# Altium project Proyecto_TD3.PrjPcb
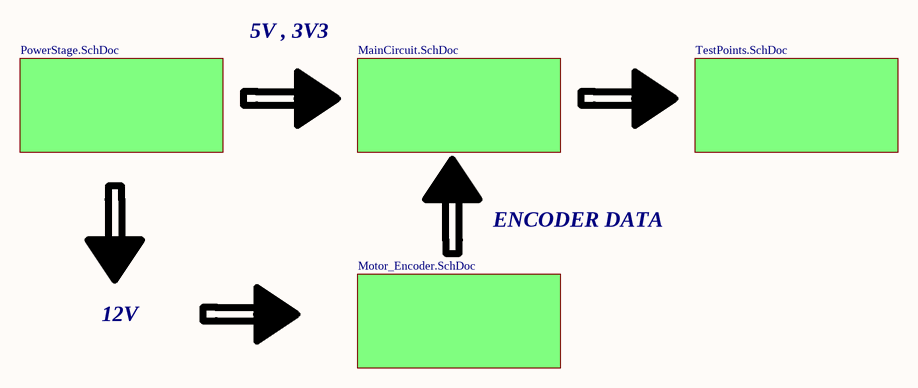
[diagram p0: Main_Sch.SchDoc]
5 sheets, 56 parts. Net scope: global (net labels, ports and power ports of the same name join across sheets).
Board file: PCB1.PcbDoc
Sheets:
  Main_Sch.SchDoc
    Designator = MainCircuit.SchDoc
    Designator = PowerStage.SchDoc
    Designator = Motor_Encoder.SchDoc
    Designator = TestPoints.SchDoc

## Sheet Main_Sch.SchDoc: Controlador PID
size A4; Organization: Altium Limited; Address1: L3, 12a Rodborough Rd; Address2: Frenchs Forest; Address3: NSW; Address4: Australia 2086; Revision: R00; sheetnumberh: 1; sheettotall: 5; Alumno: Irumberry Juan - Matwiejczuk Leandro; Curso: 512; Materia: Técnicas Digitales III; Docentes: Ing. Marín Ariel

### Sub-sheets
Designator = MainCircuit.SchDoc: no entries
Designator = PowerStage.SchDoc: no entries
Designator = Motor_Encoder.SchDoc: no entries
Designator = TestPoints.SchDoc: no entries

### Notes on the sheet
- 5V , 3V3
- ENCODER DATA
- 12V
- Title:
- Revision:
- Alumnos:
- Materia:
- Docente:
- Curso:
- File:
- Date:
- Sheet
- of

## Sheet MainCircuit.SchDoc: Controlador PID
size A4; Organization: Altium Limited; Address1: L3, 12a Rodborough Rd; Address2: Frenchs Forest; Address3: NSW; Address4: Australia 2086; Revision: R00; sheetnumberh: 2; sheettotall: 5; Alumno: Irumberry Juan - Matwiejczuk Leandro; Curso: 512; Materia: Técnicas Digitales III; Docentes: Ing. Marín Ariel; SheetNumber: 2; SheetTotal: 5
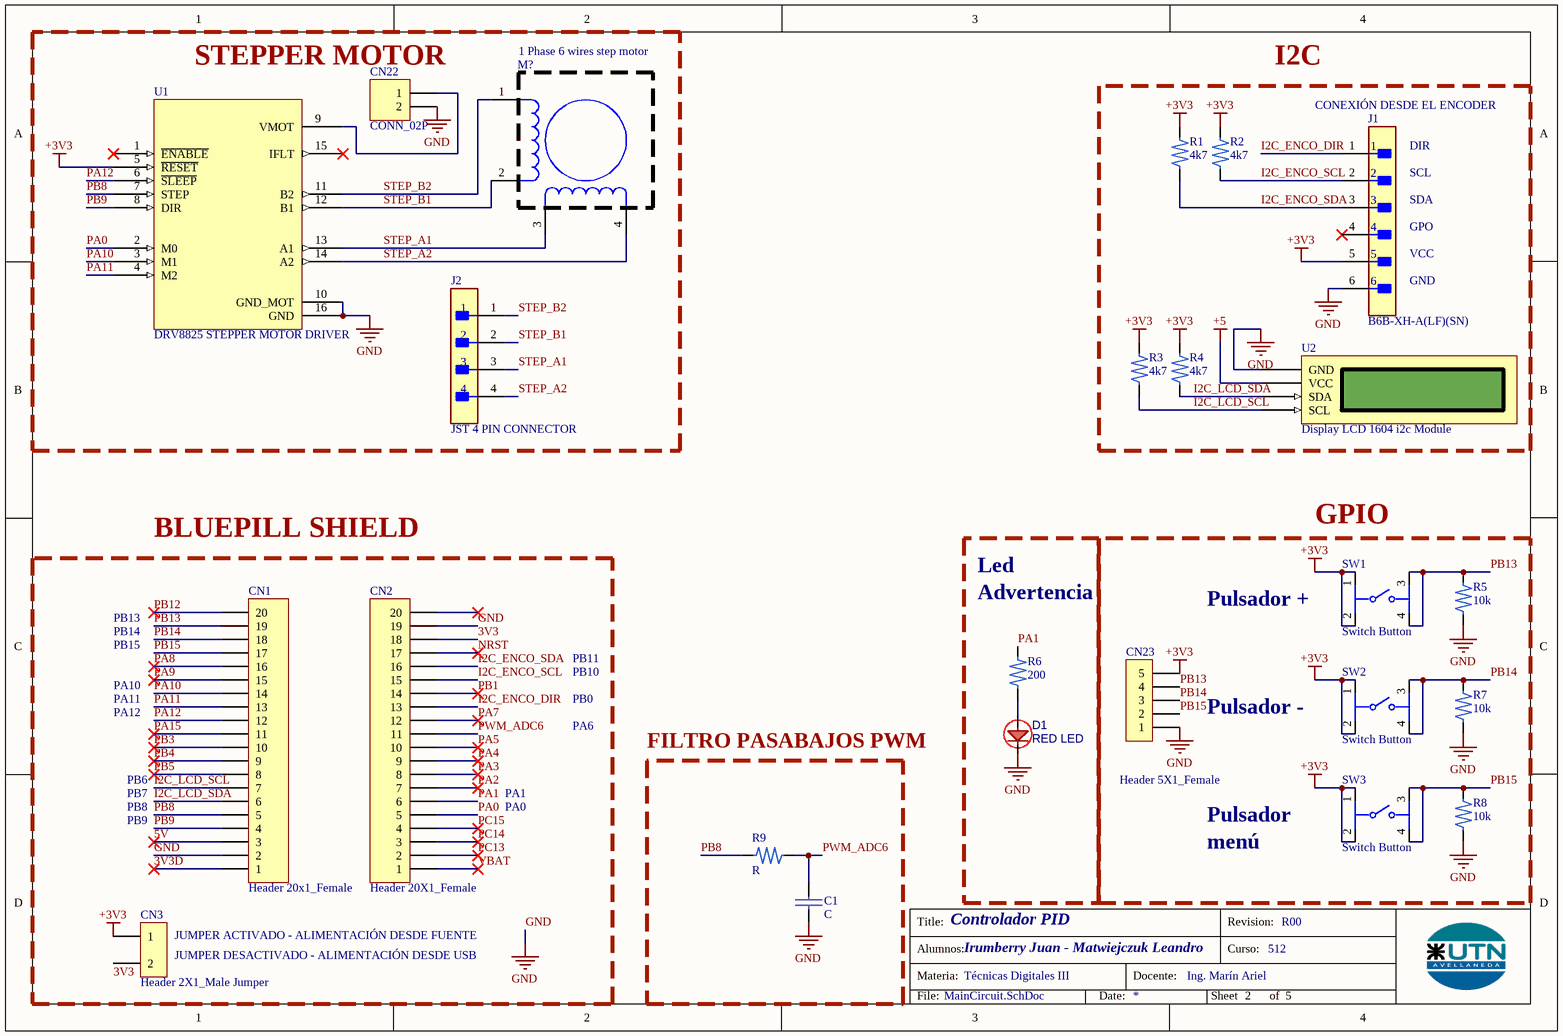
[diagram p1: MainCircuit.SchDoc]

### Parts
C1  C  [CAP_Axial_0.2mm]
CN1  Header 20x1_Female  [SPECIAL P_FEMALE_LEFT_BLUEPILL]
CN2  Header 20X1_Female  [1*20P_FEMALE]
CN3  Header 2X1_Male Jumper  [JUMPER 2x1 PIN]
CN22  CONN_02P  [TERMINAL_BLOCK_2_PIN]
CN23  Header 5X1_Female  [1*5P_FEMALE]
D1  RED LED  [LED_DIODE_3.9mm]
J1  B6B-XH-A(LF)(SN)  [JST 6 PIN CONNECTOR]
J2  JST 4 PIN CONNECTOR  [JST 4 PIN CONNECTOR]
M?  1 Phase 6 wires step motor  (graphical)
R1  4k7  [RES_AXIAL_3.2_6MM]
R2  4k7  [RES_AXIAL_3.2_6MM]
R3  4k7  [RES_AXIAL_3.2_6MM]
R4  4k7  [RES_AXIAL_3.2_6MM]
R5  10k  [RES_AXIAL_3.2_6MM]
R6  200  [RES_AXIAL_3.2_6MM]
R7  10k  [RES_AXIAL_3.2_6MM]
R8  10k  [RES_AXIAL_3.2_6MM]
R9  R  [RES_AXIAL_3.2_6MM]
SW1  Switch Button  [SWITCH]
SW2  Switch Button  [SWITCH]
SW3  Switch Button  [SWITCH]
U1  DRV8825 STEPPER MOTOR DRIVER  [IC_DRV8825_MODULE]
U2  Display LCD 1604 i2c Module  [1*4P_FEMALE]

### Blocks framed on the sheet
STEPPER MOTOR: CN22 J2 M? U1
I2C: J1 R1-R4 U2
BLUEPILL SHIELD: CN1-CN3
GPIO: CN23 R5 R7 R8 SW1-SW3
FILTRO PASABAJOS PWM: C1 R9

### Nets
+3V3: CN3.1 CN23.5 J1.5 R1.2 R2.2 R3.2 R4.2 SW1.1 SW1.2 SW2.1 SW2.2 SW3.1 SW3.2 U1.5(~{RESET})
+5: U2.2(VCC)
GND: C1.2 CN1.2 CN2.19 CN22.2 CN23.1 D1.K J1.6 R5.1 R7.1 R8.1 U1.10(GND_MOT) U1.16(GND) U2.1(GND)
3V3: CN2.18 CN3.2
3V3D: CN1.1
5V: CN1.3
I2C_ENCO_DIR: CN2.13 J1.1
I2C_ENCO_SCL: CN2.15 J1.2 R2.1
I2C_ENCO_SDA: CN2.16 J1.3 R1.1
I2C_LCD_SCL: CN1.7 R3.1 U2.4(SCL)
I2C_LCD_SDA: CN1.6 R4.1 U2.3(SDA)
NRST: CN2.17
PA0: CN2.5 U1.2(M0)
PA1: CN2.6 R6.2
PA2: CN2.7
PA3: CN2.8
PA4: CN2.9
PA5: CN2.10
PA7: CN2.12
PA8: CN1.16
PA9: CN1.15
PA10: CN1.14 U1.3(M1)
PA11: CN1.13 U1.4(M2)
PA12: CN1.12 U1.6(~{SLEEP})
PA15: CN1.11
PB1: CN2.14
PB3: CN1.10
PB4: CN1.9
PB5: CN1.8
PB8: CN1.5 R9.1 U1.7(STEP)
PB9: CN1.4 U1.8(DIR)
PB12: CN1.20
PB13: CN1.19 CN23.4 R5.2 SW1.3 SW1.4
PB14: CN1.18 CN23.3 R7.2 SW2.3 SW2.4
PB15: CN1.17 CN23.2 R8.2 SW3.3 SW3.4
PC13: CN2.2
PC14: CN2.3
PC15: CN2.4
PWM_ADC6: C1.1 CN2.11 R9.2
STEP_A1: J2.3 M?.3 U1.13(A1)
STEP_A2: J2.4 M?.4 U1.14(A2)
STEP_B1: J2.2 M?.2 U1.12(B1)
STEP_B2: J2.1 M?.1 U1.11(B2)
VBAT: CN2.1
NetCN22_1: CN22.1 U1.9(VMOT)
NetD1_A: D1.A R6.1

Not connected (* = marked no-connect by the designer): CN2 20*; J1 4*; U1 1(~{ENABLE})* 15(IFLT)*

### Notes on the sheet
- (near J1) CONEXIÓN DESDE EL ENCODER
- (near J1) DIR
- (near J1) SCL
- (near J1) SDA
- (near J1) GPO
- (near J1) VCC
- (near J1) GND
- Led
- PB14
- PB15
- PB13
- Advertencia
- (near SW1) Pulsador +
- PA10
- PA11
- PA12
- PB10
- PB11
- PB0
- Pulsador -
- PB6
- PA6
- PB7
- PB8
- PB9
- PA1
- PA0
- Pulsador
- menú
- (near CN3) JUMPER ACTIVADO - ALIMENTACIÓN DESDE FUENTE
- (near CN3) JUMPER DESACTIVADO - ALIMENTACIÓN DESDE USB
- Title:
- Revision:
- Alumnos:
- Materia:
- Docente:
- Curso:
- File:
- Date:
- Sheet
- of

### Library data of the parts
C1 = CAP_NP: Non-Polarized Capacitor
CN1 CN2 = Header 20x1_Female: Header, 16-Pin, Single row,female
CN3 = Jumper 2 Pin: Header, 2-Pin, Single row,male; LatestRevisionDate: 17-Jul-2002; LatestRevisionNote: Re-released for DXP Platform.; Publisher: Altium Limited
CN22 = CONN_02P: Connector Generic 2 Vias
CN23 = Header 5X1_Female: Header, 5-Pin, Single row,female; LatestRevisionDate: 17-Jul-2002; LatestRevisionNote: Re-released for DXP Platform.; Publisher: Altium Limited
D1 = LED
J1 = JST 6 PIN: CONN HEADER VERT 6POS 2.5MM
J2 = JST 4 PIN: CONN HEADER VERT 4POS 2.5MM; Number of Contacts: 4; Contact Resistance: 20mR; Voltage Rating: 250V; Max Current Rating: 3A; Gender: Male; Wire/Cable Gauge: 22AWG; Mated Stacking Heights: 9.8mm; Insulation Resistance: 1GR; Orientation: Straight; Contact Type: Male Pin; Contact Finish - Mating: TIN; Series: XH; Max Voltage Rating (AC): 250V; Lead Pitch: 2.5mm; Contact Shape: Square; Insulation Color: Natural; Termination: Solder; Lead Free: Lead Free; Voltage Rating (AC): 250V; Number of Rows: 1; Flammability Rating: UL94 V-0; Number of Positions: 4; Max Operating Temperature: 85°C; Package Quantity: 500; Mount: Through Hole; REACH SVHC: No SVHC; Connector Type: Header; Insulation Material: Nylon; Fastening Type: Detent; Min Operating Temperature: -25°C; Housing Color: White; Packaging: Bulk; Contact Plating: Tin; Contact Material: Brass; Max Voltage Rating (DC): 250V; Housing Material: Polyamide; Color: Natural; Material: Polyamide; Pitch: 2.5mm; Depth: 5.75mm; Current Rating: 3A; Length: 12.4mm
M? = Stepper Motor: Stepper Motor 1 Phase 6 wires
R1-R9 = RES: Through-hole Resistor
SW1-SW3 = Switch Button: SWITCH TACTILE SPST-NO 0.05A 24V; Manufacturer: TE Connectivity; Manufacturer Part Number: 1-1825910-4; Operating Force: 160gf; Contact Current Rating: 50mA; Electromechanical Life: 100000Cycles; Contact Resistance: 100mΩ; Octopart: https://octopart.com/1-1825910-4-te+connectivity-42270468; ComponentLink2URL: https://www.te.com/commerce/DocumentDelivery/DDEController?Action=showdoc&DocId=Customer+Drawing%7F1825910%7FC10%7Fpdf%7FEnglish%7FENG_CD_1825910_C10.pdf%7F1-1825910-4; Throw Configuration: SPST-NO; Height: 9.8mm; Package: 1-1825910-4; Automotive: No; Device Class L2: Switches; Voltage Rating Dc: 24V; Temperature Range High: +85°C; Device Class L3: Tactile Switches; Mouser Description: Tactile Switches 6MM ACTHIGH TEMP TACT SWITCH; Lead Free: Yes; Temperature Range Low: -35°C; Digikey Description: SWITCH TACTILE SPST-NO 0.05A 24V; Device Class L1: Electromechanical; Mount: Through Hole; RoHS: TRUE; ComponentLink2Description: Datasheet; Temperature: -35°C to +85°C; Category: Switch
U1 = DRV8825 Module: DRV8825 STEPPER MOTOR DRIVER ,Stepper, Bipolar 8.2 ~ 45VDC Supply 1.5A 8.2 ~ 45V Load

## Sheet PowerStage.SchDoc: Controlador PID
size A4; Organization: Altium Limited; Address1: L3, 12a Rodborough Rd; Address2: Frenchs Forest; Address3: NSW; Address4: Australia 2086; Revision: R00; sheetnumberh: 3; sheettotall: 5; Alumno: Irumberry Juan - Matwiejczuk Leandro; Curso: 512; Materia: Técnicas Digitales III; Docentes: Ing. Marín Ariel; SheetNumber: 3; SheetTotal: 5
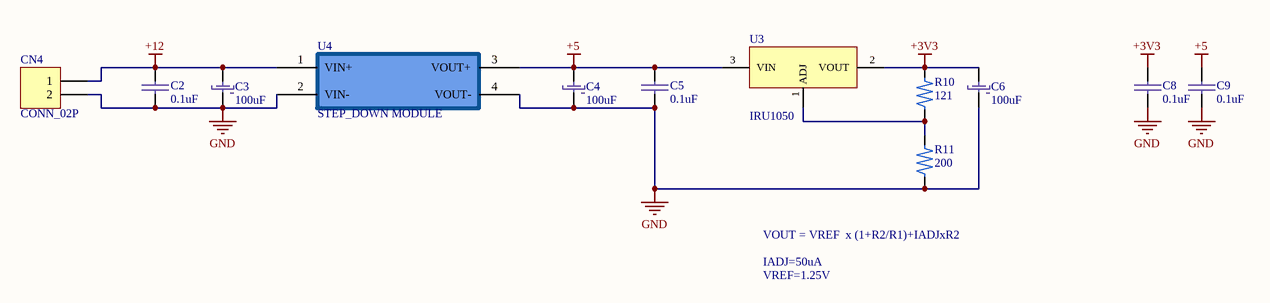
[diagram p2: PowerStage.SchDoc]

### Parts
C2  0.1uF  [CAP_Axial_0.2mm]
C3  100uF  [C_RAD_11MM]
C4  100uF  [C_RAD_5mm]
C5  0.1uF  [CAP_Axial_0.2mm]
C6  100uF  [C_RAD_5mm]
C8  0.1uF  [CAP_Axial_0.2mm]
C9  0.1uF  [CAP_Axial_0.2mm]
CN4  CONN_02P  [TERMINAL_BLOCK_2_PIN]
R10  121  [RES_AXIAL_3.2_6MM]
R11  200  [RES_AXIAL_3.2_6MM]
U3  IRU1050  [IRU1050]
U4  STEP_DOWN MODULE  [STEP_DOWN_MODULE]

### Nets
+3V3: C6.1 C8.1 R10.2 U3.2(VOUT)
+5: C4.1 C5.1 C9.1 U3.3(VIN) U4.3(VOUT+)
+12: C2.1 C3.1 CN4.1 U4.1(VIN+)
GND: C2.2 C3.2 C4.2 C5.2 C6.2 C8.2 C9.2 CN4.2 R11.1 U4.2(VIN-) U4.4(VOUT-)
NetR10_1: R10.1 R11.2 U3.1(ADJ)

### Notes on the sheet
- VOUT = VREF  x (1+R2/R1)+IADJxR2
- IADJ=50uA
- VREF=1.25V
- Title:
- Revision:
- Alumnos:
- Materia:
- Docente:
- Curso:
- File:
- Date:
- Sheet
- of

### Library data of the parts
C2 C5 C8 C9 = CAP_NP: Non-Polarized Capacitor
C3 C4 C6 = Cap_Pol: Polarized Capacitor
CN4 = CONN_02P: Connector Generic 2 Vias
R10 R11 = RES: Through-hole Resistor
U3 = IRU1050: 5A  LOW DROPOUT POSITIVEADJUSTABLE REGULATOR
U4 = STEP_DOWN_MODULE

## Sheet Motor_Encoder.SchDoc: Controlador PID
size A4; Organization: Altium Limited; Address1: L3, 12a Rodborough Rd; Address2: Frenchs Forest; Address3: NSW; Address4: Australia 2086; Revision: R00; sheetnumberh: 4; sheettotall: 5; Alumno: Irumberry Juan - Matwiejczuk Leandro; Curso: 512; Materia: Técnicas Digitales III; Docentes: Ing. Marín Ariel
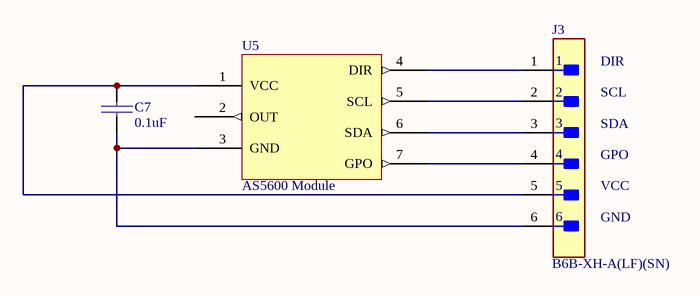
[diagram p3: Motor_Encoder.SchDoc]

### Parts
C7  0.1uF  [CAP_Axial_0.2mm]
J3  B6B-XH-A(LF)(SN)  [JST 6 PIN CONNECTOR]
U5  AS5600 Module  [AS5600 Module]

### Nets
NetC7_1: C7.1 J3.5 U5.1(VCC)
NetC7_2: C7.2 J3.6 U5.3(GND)
NetJ3_1: J3.1 U5.4(DIR)
NetJ3_2: J3.2 U5.5(SCL)
NetJ3_3: J3.3 U5.6(SDA)
NetJ3_4: J3.4 U5.7(GPO)

Not connected (* = marked no-connect by the designer): U5 2(OUT)

### Notes on the sheet
- (near J3) DIR
- (near J3) SCL
- (near J3) SDA
- (near J3) GPO
- (near J3) VCC
- (near J3) GND
- Title:
- Revision:
- Alumnos:
- Materia:
- Docente:
- Curso:
- File:
- Date:
- Sheet
- of

### Library data of the parts
C7 = CAP_NP: Non-Polarized Capacitor
J3 = JST 6 PIN: CONN HEADER VERT 6POS 2.5MM
U5 = AS5600 Module: AS5600 Magnetic Angle Sensor Encoder Module

## Sheet TestPoints.SchDoc: Controlador PID
size A4; Organization: Altium Limited; Address1: L3, 12a Rodborough Rd; Address2: Frenchs Forest; Address3: NSW; Address4: Australia 2086; Revision: R00; sheetnumberh: 5; sheettotall: 5; Alumno: Irumberry Juan - Matwiejczuk Leandro; Curso: 512; Materia: Técnicas Digitales III; Docentes: Ing. Marín Ariel; SheetNumber: 5; SheetTotal: 5
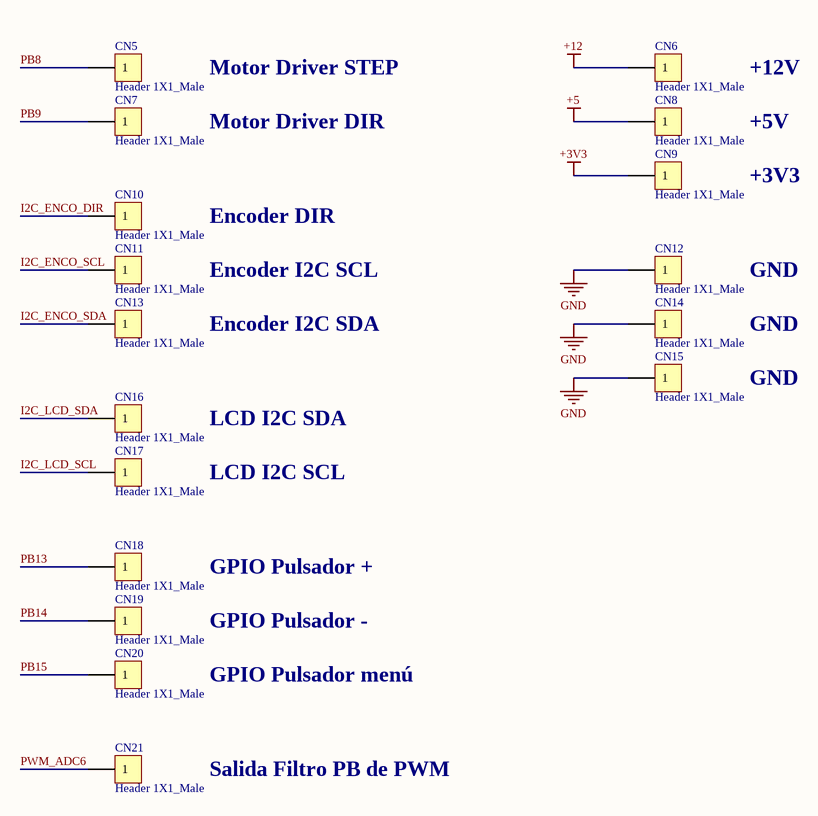
[diagram p4: TestPoints.SchDoc]

### Parts
CN5  Header 1X1_Male  [1*1P_MALE]
CN6  Header 1X1_Male  [1*1P_MALE]
CN7  Header 1X1_Male  [1*1P_MALE]
CN8  Header 1X1_Male  [1*1P_MALE]
CN9  Header 1X1_Male  [1*1P_MALE]
CN10  Header 1X1_Male  [1*1P_MALE]
CN11  Header 1X1_Male  [1*1P_MALE]
CN12  Header 1X1_Male  [1*1P_MALE]
CN13  Header 1X1_Male  [1*1P_MALE]
CN14  Header 1X1_Male  [1*1P_MALE]
CN15  Header 1X1_Male  [1*1P_MALE]
CN16  Header 1X1_Male  [1*1P_MALE]
CN17  Header 1X1_Male  [1*1P_MALE]
CN18  Header 1X1_Male  [1*1P_MALE]
CN19  Header 1X1_Male  [1*1P_MALE]
CN20  Header 1X1_Male  [1*1P_MALE]
CN21  Header 1X1_Male  [1*1P_MALE]

### Nets
+3V3: CN9.1
+5: CN8.1
+12: CN6.1
GND: CN12.1 CN14.1 CN15.1
I2C_ENCO_DIR: CN10.1
I2C_ENCO_SCL: CN11.1
I2C_ENCO_SDA: CN13.1
I2C_LCD_SCL: CN17.1
I2C_LCD_SDA: CN16.1
PB8: CN5.1
PB9: CN7.1
PB13: CN18.1
PB14: CN19.1
PB15: CN20.1
PWM_ADC6: CN21.1

### Notes on the sheet
- Motor Driver STEP
- +12V
- Motor Driver DIR
- +5V
- Encoder DIR
- +3V3
- Encoder I2C SCL
- GND
- Encoder I2C SDA
- LCD I2C SDA
- LCD I2C SCL
- GPIO Pulsador +
- GPIO Pulsador -
- GPIO Pulsador menú
- Salida Filtro PB de PWM
- Title:
- Revision:
- Alumnos:
- Materia:
- Docente:
- Curso:
- File:
- Date:
- Sheet
- of

### Library data of the parts
CN5-CN21 = Header 1X1_Male: Header, 1-Pin, Single row,male; LatestRevisionDate: 17-Jul-2002; LatestRevisionNote: Re-released for DXP Platform.; Publisher: Altium Limited

## Nets that join several sheets
+3V3: MainCircuit (14 pins), PowerStage (C6.1 C8.1 R10.2 U3.2), TestPoints (CN9.1)
+5: MainCircuit (U2.2), PowerStage (5 pins), TestPoints (CN8.1)
+12: PowerStage (C2.1 C3.1 CN4.1 U4.1), TestPoints (CN6.1)
GND: MainCircuit (13 pins), PowerStage (11 pins), TestPoints (CN12.1 CN14.1 CN15.1)
I2C_ENCO_DIR: MainCircuit (CN2.13 J1.1), TestPoints (CN10.1)
I2C_ENCO_SCL: MainCircuit (CN2.15 J1.2 R2.1), TestPoints (CN11.1)
I2C_ENCO_SDA: MainCircuit (CN2.16 J1.3 R1.1), TestPoints (CN13.1)
I2C_LCD_SCL: MainCircuit (CN1.7 R3.1 U2.4), TestPoints (CN17.1)
I2C_LCD_SDA: MainCircuit (CN1.6 R4.1 U2.3), TestPoints (CN16.1)
PB8: MainCircuit (CN1.5 R9.1 U1.7), TestPoints (CN5.1)
PB9: MainCircuit (CN1.4 U1.8), TestPoints (CN7.1)
PB13: MainCircuit (5 pins), TestPoints (CN18.1)
PB14: MainCircuit (5 pins), TestPoints (CN19.1)
PB15: MainCircuit (5 pins), TestPoints (CN20.1)
PWM_ADC6: MainCircuit (C1.1 CN2.11 R9.2), TestPoints (CN21.1)